# Altium schematic sheet 92.KEY.SchDoc
size 297 x 209 mm; Revision: V2.1; Schematic Page Number: 11; Page Number: 39; Check: Default; Schematic Name: RK_NVR_DEMO1_RK3588_LP4/4x_V21; Page Count: 43; Page name: 92.KEY; Designer: Zhangdz; Schematic Page Count: 99; Revcode: V2.1; DsnPath: E:\Work\SBER\RK3588_SOM\temp\RK_NVR_DEMO1_RK3588_LP4XD200P232SD8_V21_20211228.DSN; SchematicName: RK_NVR_DEMO1_RK3588_LP4/4x_V21; PageName: 92.KEY; PageSize: A4; TopSchematic: True
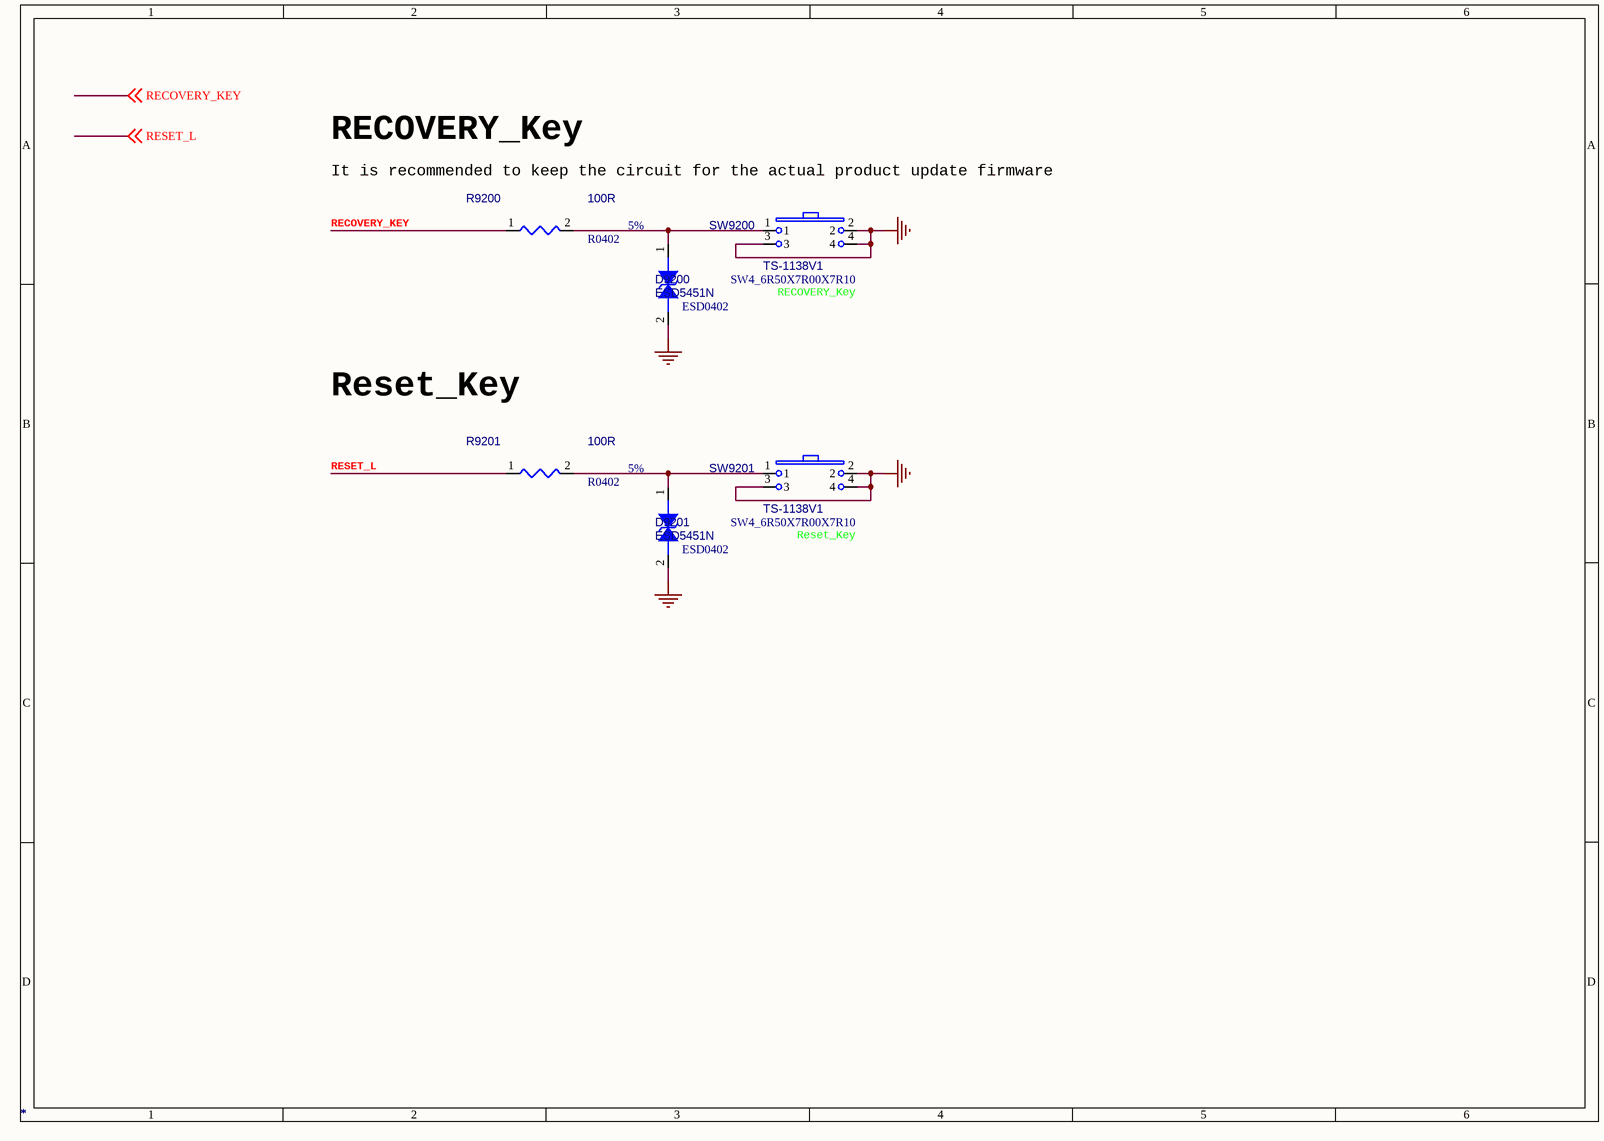
[diagram p0: 92.KEY.SchDoc]

## Parts
D9200  *  [ESD0402]
D9201  *  [ESD0402]
R9200  *  Tolerance: 5%  [R0402]
R9201  *  Tolerance: 5%  [R0402]
SW9200  *  PCB Footprint: SW4_6R50X7R00X7R10  Option: RECOVERY_Key  [YC-6615B]
SW9201  *  PCB Footprint: SW4_6R50X7R00X7R10  Option: Reset_Key  [YC-6615B]

## Nets
GND: D9200.2 D9201.2 SW9200.2 SW9200.3 SW9200.4 SW9201.2 SW9201.3 SW9201.4
RECOVERY_KEY: R9200.1 ; off-sheet RECOVERY_KEY
RESET_L: R9201.1 ; off-sheet RESET_L
NetD9200_1: D9200.1 R9200.2 SW9200.1
NetD9201_1: D9201.1 R9201.2 SW9201.1

## Notes on the sheet
- RECOVERY_Key
- It is recommended to keep the circuit for the actual product update firmware
- Reset_Key

## Library data of the parts
D9200 = DIODE BI_DIR TRIG: 1-Line, Bi-directional, Transient Voltage Suppressors.17.5pF.; Part Reference: D9200; Manufacturer: WillSemi(О¤¶ы°лµјМе); Value: ESD5451N; Priority: A; PCB Footprint: ESD0402; Created by: JJJ; Manufacturer PN: ESD5451N; Part Type: ESD_TVS; RK PN: ESD5451N
D9201 = DIODE BI_DIR TRIG: 1-Line, Bi-directional, Transient Voltage Suppressors.17.5pF.; Part Reference: D9201; Manufacturer: WillSemi(О¤¶ы°лµјМе); Value: ESD5451N; Priority: A; PCB Footprint: ESD0402; Created by: JJJ; Manufacturer PN: ESD5451N; Part Type: ESD_TVS; RK PN: ESD5451N
R9200 = RESISTOR_Dup1: НЁУГєсД¤µзЧи,100R,+/-5%,R0402,1/16W.; Part Reference: R9200; Manufacturer PN: RC0402JR-07100RL; Manufacturer: YAGEO; Wattage: 1/16W; Priority: A; PCB Footprint: R0402; Value: 100R; Created by: YTL; Part Type: НЁУГєсД¤µзЧи; RK PN: RC0402JR-07100RL
R9201 = RESISTOR_Dup1: НЁУГєсД¤µзЧи,100R,+/-5%,R0402,1/16W.; Part Reference: R9201; Manufacturer: YAGEO; RK PN: RC0402JR-07100RL; Priority: A; Wattage: 1/16W; PCB Footprint: R0402; Value: 100R; Part Type: НЁУГєсД¤µзЧи; Manufacturer PN: RC0402JR-07100RL; Created by: YTL
SW9200 = KEY_4PIN: 4ЅЕЈ¬Іа±ЯЈ¬ІејюЈ¬6.5MMx7.1MM°ґјь; Part Reference: SW9200; Manufacturer: Сw»ЄµзЧУ; Value: TS-1138V1; Priority: A; Created by: YWQ; Manufacturer Part Number: TS-1138V1; Part Type: KEY; RK PN: TS-1138V1
SW9201 = KEY_4PIN: 4ЅЕЈ¬Іа±ЯЈ¬ІејюЈ¬6.5MMx7.1MM°ґјь; Part Reference: SW9201; Manufacturer: Сw»ЄµзЧУ; Value: TS-1138V1; Priority: A; RK PN: TS-1138V1; Part Type: KEY; Manufacturer Part Number: TS-1138V1; Created by: YWQ